# Altium schematic sheet Antenna Network.SchDoc: GSM Antenna Network
size A4
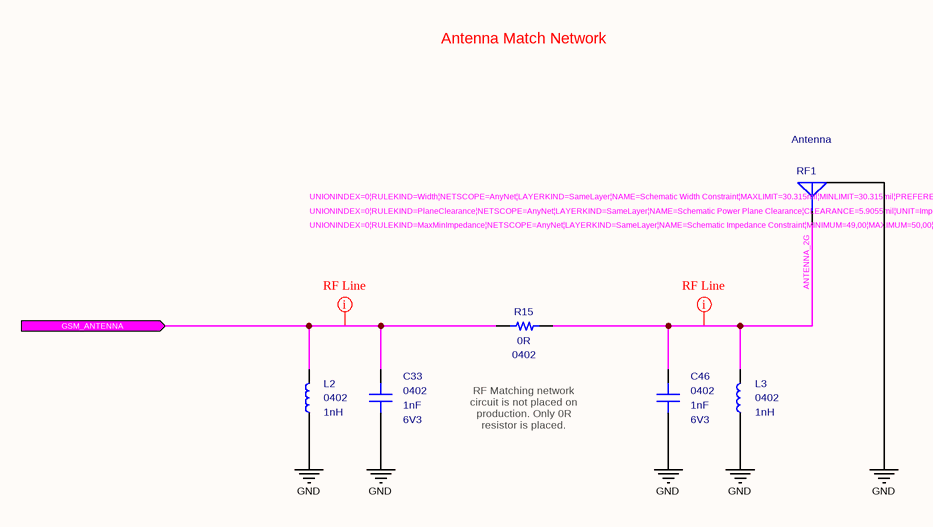
[diagram p0: Antenna Network.SchDoc]

## Parts
C33  value 1nF  Case: 0402  Voltage: 6V3  [CAPACITOR_0402]  (hidden comment: Multilayer Ceramic Capacitor)
C46  value 1nF  Case: 0402  Voltage: 6V3  [CAPACITOR_0402]  (hidden comment: Multilayer Ceramic Capacitor)
L2  value 1nH  Case: 0402  [INDUCTOR_0402]  (hidden comment: Fixed Inductor)
L3  value 1nH  Case: 0402  [INDUCTOR_0402]  (hidden comment: Fixed Inductor)
R15  value 0R  Case: 0402  [RESISTOR_0402]  (hidden comment: Thick Film Resistor)
RF1  Antenna  [Connector_IPEX]

## Ports
GSM_ANTENNA (in)

## Nets
GND: C33.1 C46.1 L2.1 L3.1 RF1.2(GND)
ANTENNA_2G: C46.2 L3.2 R15.1 RF1.1(Signal)
GSM_ANTENNA: C33.2 L2.2 R15.2 ; port GSM_ANTENNA

## Layout directives
rule Impedance Constraint [Min = 49.00    Max = 50.00    ]; rule Power Plane Clearance [Clearance = 5.906mil]; rule Width Constraint [Pref Width = 0.77mm    Min Width = 0.77mm    Max Width = 0.77mm]: ANTENNA_2G, GSM_ANTENNA

## Notes on the sheet
- Antenna Match Network
- RF Matching network circuit is not placed on production. Only 0R resistor is placed.
- Title
- Size:
- Date:
- A4
- Number:
- Time:
- Revision:
- Sheet
- of
- File:

## Library data of the parts
C33 C46 = Capacitor - 1nF [0402-6V3): Capacitor - 1nF [0402] (Ceramic); Manufacturer_Name: AVX; Manufacturer_Part_Number: 04026C102MAT2A; Dielectric: X7R; Tolerance: 20%; Height: 0.25mm; Mouser_Part_Number: 581-04026C102MAT2A; Mouser Price/Stock: 0.074; Maximum Operating Temperature: +125; Minimum Operating Temperature: -55; ROHS: Yes; Weight: 0.65mg; ComponentLink1Description: Datasheet; ComponentLink1URL: https://www.mouser.com.tr/datasheet/2/40/X7RDielectric-777024.pdf; Supplier 1: Mouser; Supplier Part Number 1: 581-04026C102MAT2A
L2 L3 = Inductor - 1nH [0402]: Manufacturer_Name: Murata Electronics; Manufacturer_Part_Number: LQG15HN1N0S02D; Tolerance: 0.3 nH; Height: 0.35mm; Mouser_Part_Number: 81-LQG15HN1N0S02D; ComponentLink1Description: DataSheet; ComponentLink1URL: https://www.mouser.com.tr/datasheet/2/281/JELF243B-0009-1699631.pdf; ComponentLink2Description: Mouser; ComponentLink2URL: https://www.mouser.com.tr/ProductDetail/Murata-Electronics/LQG15HN1N0S02D?qs=sGAEpiMZZMsg%252By3WlYCkUySk0uOsB1dTfJeMbA4C8Pk%3D; Supplier 1: Future Electronics; Supplier 2: Future Electronics; Supplier 3: Mouser; Supplier 4: Arrow; Supplier 5: Digi-Key; Supplier Part Number 1: LQG15HN1N0S02D-CUTT; Supplier Part Number 2: LQG15HN1N0S02D-REEL; Supplier Part Number 3: 81-LQG15HN1N0S02D; Supplier Part Number 4: LQG15HN1N0S02D; Supplier Part Number 5: 490-1073-1-ND
R15 = Resistor - 0R: Thick Film Resistors - SMD 1/16 W 0 Ohms; Manufacturer_Name: Vishay; Manufacturer_Part_Number: CRCW04020000Z0ED; Height: 0.4mm; Mouser_Part_Number: 71-CRCW0402-0-E3; ComponentLink1Description: DataSheet; ComponentLink1URL: https://www.mouser.com.tr/datasheet/2/427/dcrcwe3-1762152.pdf; ComponentLink2Description: Mouser; ComponentLink2URL: https://www.mouser.com.tr/ProductDetail/Vishay-Dale/CRCW04020000Z0ED?qs=sGAEpiMZZMu61qfTUdNhG2DpbjADlD3GG34cJb50zyg%3D; Supplier 1: Mouser; Supplier 2: Digi-Key; Supplier Part Number 1: 71-CRCW0402-0-E3; Supplier Part Number 2: 541-0.0JCT-ND
RF1 = Connector - MHF: MHF Antenna Socket; ROHS: Yes; Supplier 1: Mouser; Supplier 2: Arrow; Supplier Part Number 1: 200-RSP-122811-01; Supplier Part Number 2: RSP-122811-01